# EAGLE design mainboard_v6.0.2 (EAGLE 9.6.2)
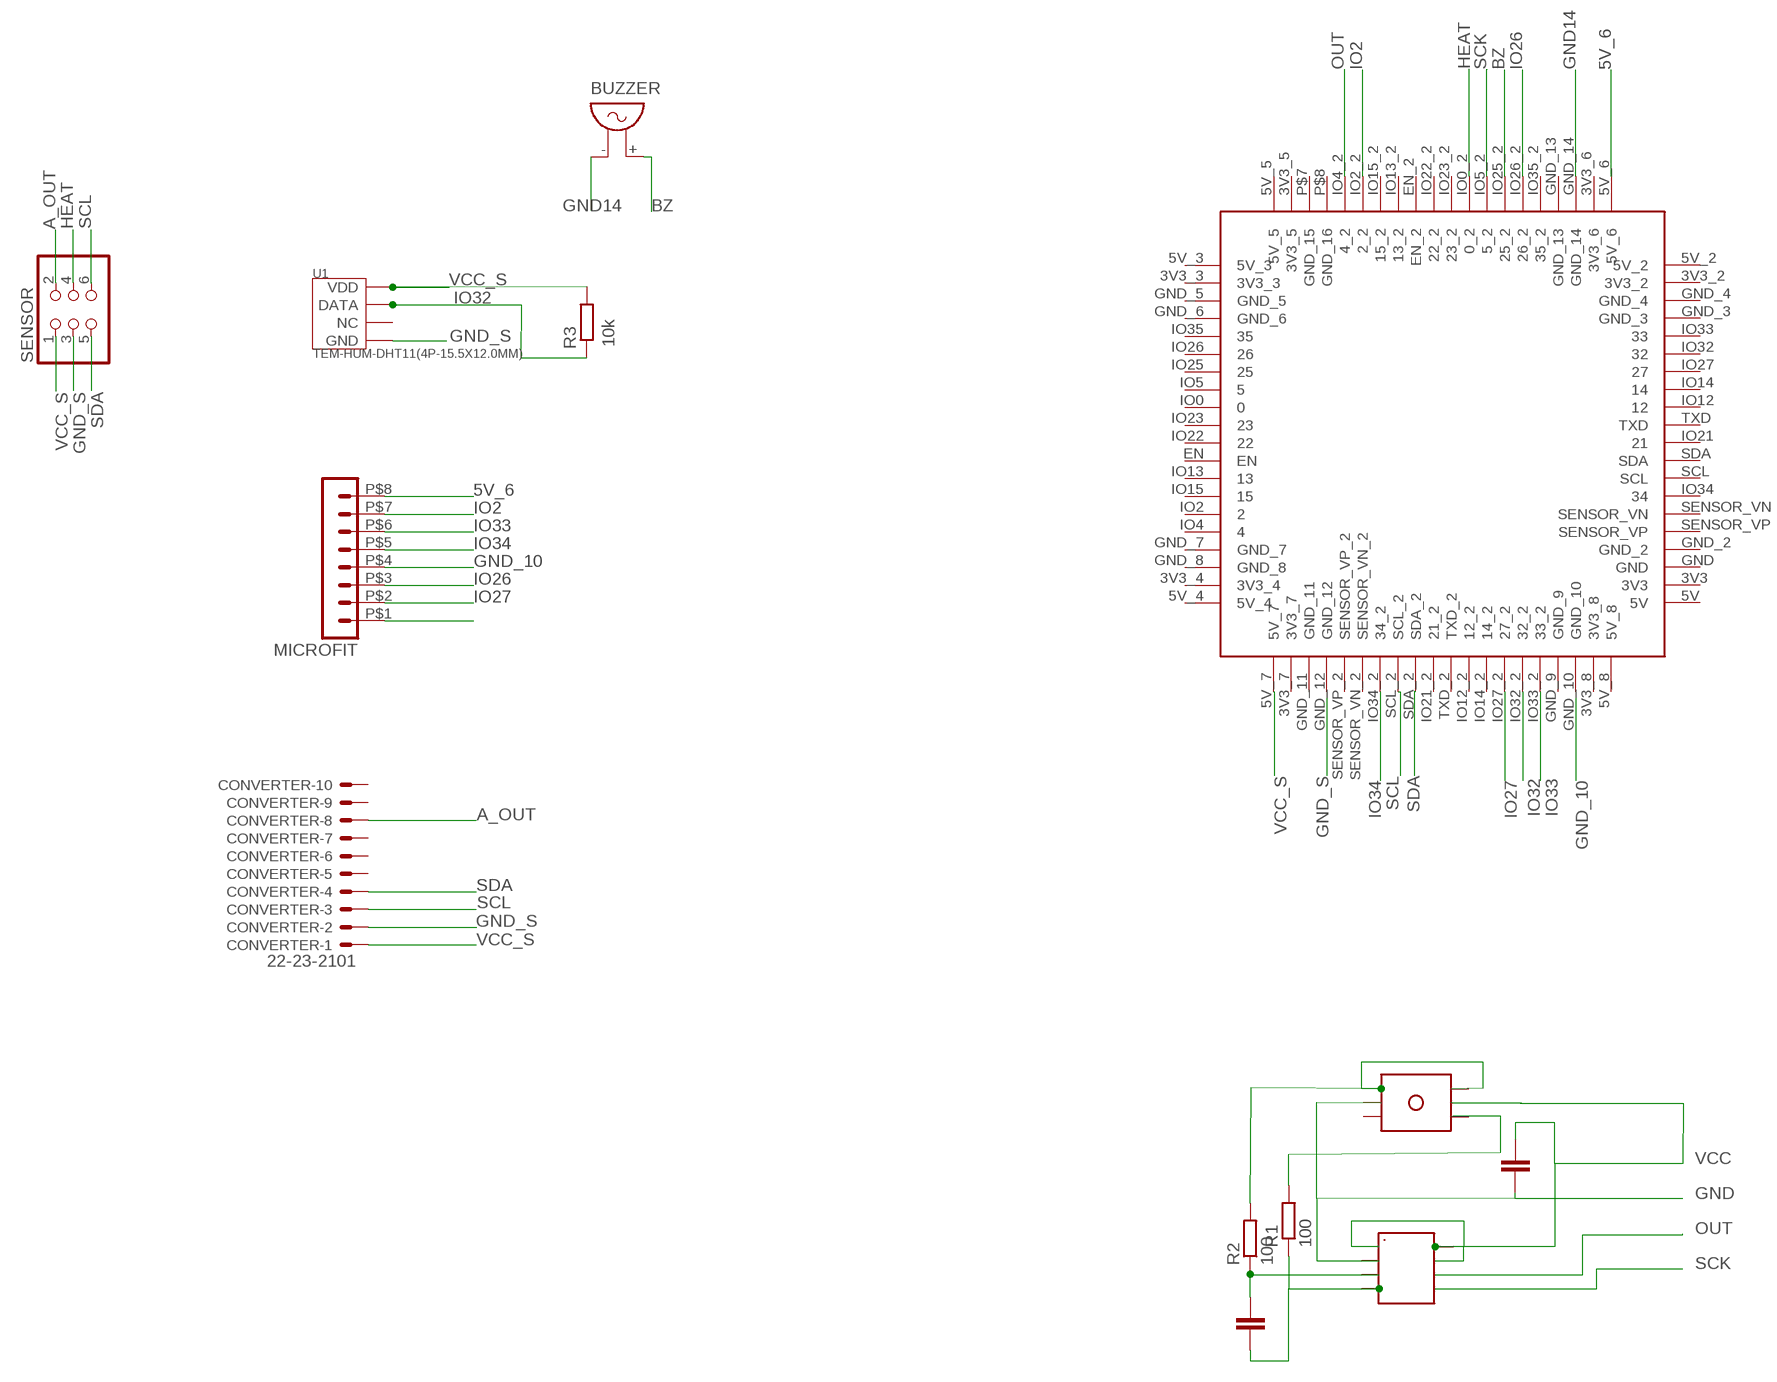
[diagram p0: schematic, sheet 1]

## Parts
BUZZER  F/QMX  [F/QMX]
C1  100n  C-EUC0805  [C0805]
C2  100n  C-EUC0805  [C0805]
CONVERTER  22-23-2101  [22-23-2101]
MICROFIT  HEADER_POS8_43045-0800  [43045-0800]
R1  100  R-EU_R0805  [R0805]
R2  100  R-EU_R0805  [R0805]
R3  10k  R-EU_R0805  [R0805]
SENSOR  PINHD-2X3  [2X03]
U1  TEM-HUM-DHT11(4P-15.5X12.0MM)  [SNR4-2.54-15.5X12.0X5.5MM]
U$1  WT32_SC01WT32_D  [WT32_DUPLICATED]
U$2  HX710B  [HX710B_SMD]
U$3  PRESSUREPRESSURE_PTH  [PRESSURE_PTH]

## Nets
5V_6: MICROFIT.P$8 U$1.5V_6
A_OUT: CONVERTER.8 SENSOR.2
BZ: BUZZER.+ U$1.IO25_2(25_2)
GND: C2.2 U$2.AGND U$3.2
GND14: BUZZER.- U$1.GND_14
GND_10: MICROFIT.P$4 U$1.GND_10
GND_S: CONVERTER.2 SENSOR.3 U1.4(GND) U$1.GND_12
HEAT: SENSOR.4 U$1.IO0_2(0_2)
IO2: MICROFIT.P$7 U$1.IO2_2(2_2)
IO26: MICROFIT.P$3 U$1.IO26_2(26_2)
IO27: MICROFIT.P$2 U$1.IO27_2(27_2)
IO32: R3.1 U1.2(DATA) U$1.IO32_2(32_2)
IO33: MICROFIT.P$6 U$1.IO33_2(33_2)
IO34: MICROFIT.P$5 U$1.IO34_2(34_2)
N$1: C1.2 R2.1 U$2.INN
N$2: C1.1 R1.1 U$2.INP
N$5: R1.2 U$3.4
N$7: R2.2 U$3.1 U$3.6
N$8: MICROFIT.P$1
OUT: U$1.IO4_2(4_2) U$2.DOUT
SCK: U$1.IO5_2(5_2) U$2.SCK
SCL: CONVERTER.3 SENSOR.6 U$1.SCL_2
SDA: CONVERTER.4 SENSOR.5 U$1.SDA_2
VCC: C2.1 U$2.AVDD U$2.DVDD U$2.VREF U$3.5
VCC_S: CONVERTER.1 R3.2 SENSOR.1 U1.1(VDD) U$1.5V_7
Unconnected: CONVERTER.5 CONVERTER.6 CONVERTER.7 CONVERTER.9 CONVERTER.10 U1.3(NC) U$1.3V3 U$1.3V3_2 U$1.3V3_3 U$1.3V3_4 U$1.3V3_5 U$1.3V3_6 U$1.3V3_7 U$1.3V3_8 U$1.5V U$1.5V_2 U$1.5V_3 U$1.5V_4 U$1.5V_5 U$1.5V_8 U$1.EN U$1.EN_2 U$1.GND U$1.GND_2 U$1.GND_3 U$1.GND_4 U$1.GND_5 U$1.GND_6 U$1.GND_7 U$1.GND_8 U$1.GND_9 U$1.GND_11 U$1.GND_13 U$1.IO0 U$1.IO2 U$1.IO4 U$1.IO5 U$1.IO12 U$1.IO12_2(12_2) U$1.IO13 U$1.IO13_2(13_2) U$1.IO14 U$1.IO14_2(14_2) U$1.IO15 U$1.IO15_2(15_2) U$1.IO21 U$1.IO21_2(21_2) U$1.IO22 U$1.IO22_2(22_2) U$1.IO23 U$1.IO23_2(23_2) U$1.IO25 U$1.IO26 U$1.IO27 U$1.IO32 U$1.IO33 U$1.IO34 U$1.IO35 U$1.IO35_2(35_2) U$1.P$7(GND_15) U$1.P$8(GND_16) U$1.SCL U$1.SDA U$1.SENSOR_VN U$1.SENSOR_VN_2 U$1.SENSOR_VP U$1.SENSOR_VP_2 U$1.TXD U$1.TXD_2 U$3.3

## Library data of the parts
BUZZER = buzzer:F/QMX: BUZZER Source: Buerklin; OC_FARNELL: unknown; OC_NEWARK: unknown
C1 C2 = rcl@1:C-EU: CAPACITOR, European symbol
CONVERTER = con-molex:22-23-2101: .100" (2.54mm) Center Header - 10 Pin; MF: MOLEX; MPN: 22-23-2101; OC_FARNELL: 1756828; OC_NEWARK: 94C0765
MICROFIT = con-molex-micro-fit-3_0 (1):HEADER_POS8_?: Molex - Micro-Fit 3.0 Series connector, 3.00mm (0.118") pitch header, 8 positions.
R1-R3 = rcl:R-EU_: RESISTOR, European symbol; SPICEPREFIX: R
SENSOR = pinhead:PINHD-2X3: PIN HEADER
U1 = TEM-HUM-DHT11_4P-15.5X12.0MM_:TEM-HUM-DHT11(4P-15.5X12.0MM): 314010000 Check availability <https://pricing.snapeda.com/parts/DHT11/Panasonic%20Industrial%20Automation%20Sales/view-part?ref=eda>; AVAILABILITY: Not in stock; CHECK_PRICES: https://www.snapeda.com/parts/DHT11/Panasonic/view-part/?ref=eda; DESCRIPTION: Servo AC 100 ~ 120VAC Supply 10A 120V Load; MF: Panasonic Industrial Automation Sales; MP: DHT11; PACKAGE: None; PRICE: None; SNAPEDA_LINK: https://www.snapeda.com/parts/DHT11/Panasonic/view-part/?ref=snap
U$1 = WT32_SC01:WT32_SC01
U$2 = HX710B:HX710B
U$3 = PRESSURE:PRESSURE

## Board
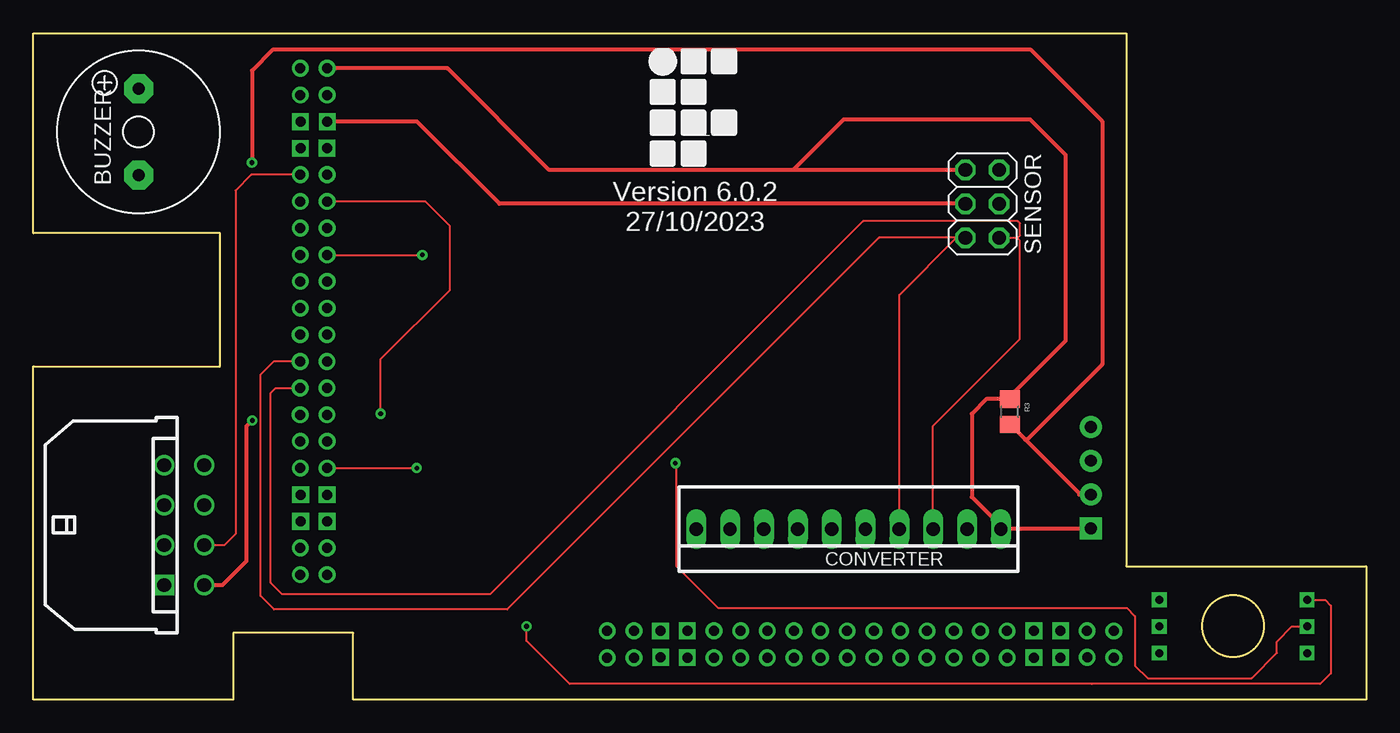
[diagram p1: board, top side]
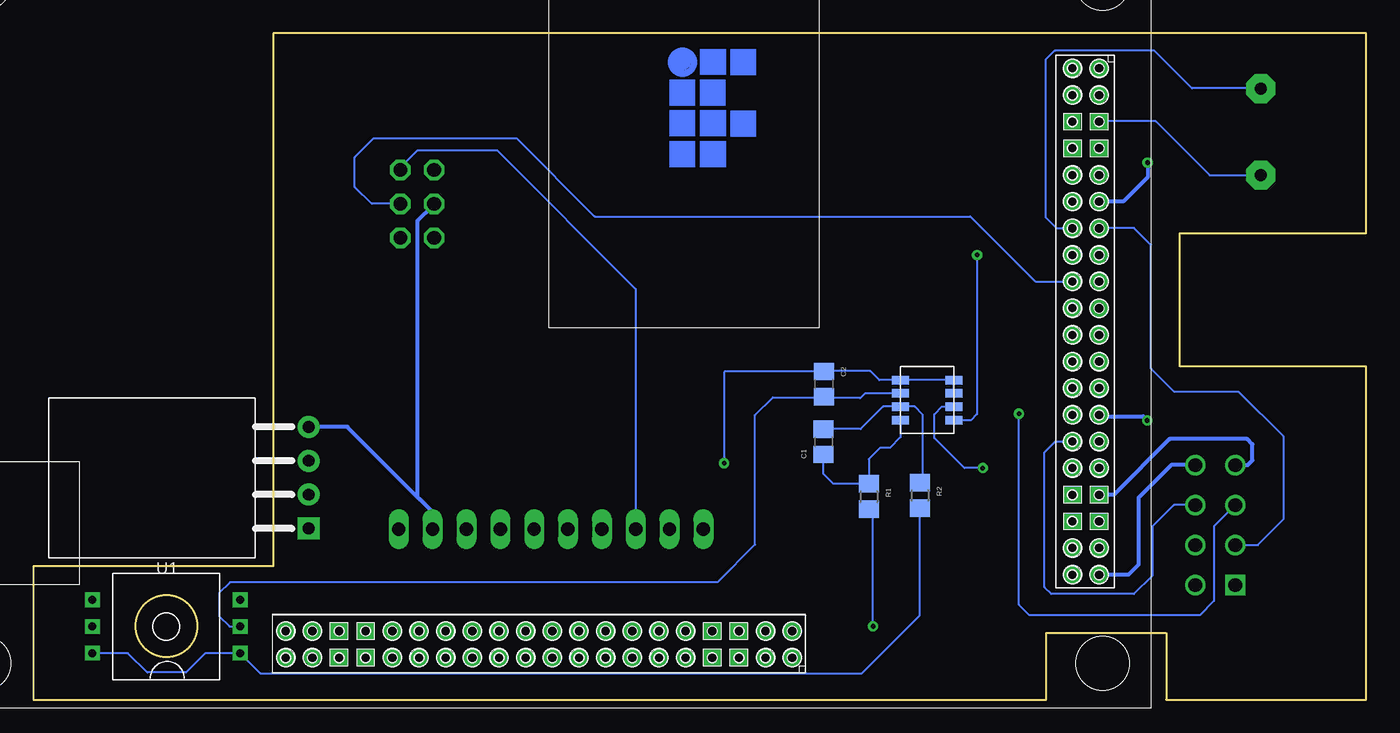
[diagram p2: board, bottom side, seen from below]

Size 100 x 50 mm. Coordinates in mm from the lower left corner, seen from the top.
Outline: 0,0 0,25 14,25 14,35 0,35 0,50 82,50 82,10 100,10 100,0 24,0 24,5 15,5 15,0 0,0
Outline: circle at 90,5.5 radius 2.3
Copper layers (1*16): Top 0.035mm / dielectric 1.5mm / Bottom 0.035mm
Design rules "default": minimum track width 6mil, minimum drill 0.35mm, track to track 6mil, track to pad 6mil, pad to pad 6mil, via to via 6mil, smd to smd 6mil, copper to edge 40mil, drill to drill 6mil, minimum pad ring 10mil, minimum via ring 8mil, stop-mask expansion 4mil, vias tented up to drill 0mil, thermal gap 10mil

### Footprints (pad centres in the part's own frame; a part is rotated, then mirrored left to right if it is on the bottom)
F/QMX = drill 0.914 pad 2.159 octagon: + 3.251,0; - -3.251,0
C0805 = smd 1.3 x 1.5: 1 -0.95,0; 2 0.95,0
22-23-2101 = drill 1 long: 1 -11.43,0; 2 -8.89,0; 3 -6.35,0; 4 -3.81,0; 5 -1.27,0; 6 1.27,0; 7 3.81,0; 8 6.35,0; 9 8.89,0; 10 11.43,0
43045-0800 = drill 1.02 square: P$1 4.5,4.32 | drill 1.02: P$2 1.5,4.32; P$3 -1.5,4.32; P$4 -4.5,4.32; P$5 4.5,7.32; P$6 1.5,7.32; P$7 -1.5,7.32; P$8 -4.5,7.32
R0805 = smd 1.3 x 1.5: 1 -0.95,0; 2 0.95,0
2X03 = drill 1.016 octagon: 1 -2.54,-1.27; 2 -2.54,1.27; 3 0,-1.27; 4 0,1.27; 5 2.54,-1.27; 6 2.54,1.27
SNR4-2.54-15.5X12.0X5.5MM = drill 0.889 pad 1.651 square: 1 -11.75,3.81 | drill 0.889 pad 1.651: 2 -11.75,1.27; 3 -11.75,-1.27; 4 -11.75,-3.81
WT32_DUPLICATED = drill 0.75: 3V3 -34.46,-21.65; 3V3_2 -34.47,-23.64; 3V3_3 -0.47,-21.65; 3V3_4 -0.47,-23.66; 3V3_5 22.56,-15.42; 3V3_6 24.57,-15.42; 3V3_7 22.56,18.57; 3V3_8 24.57,18.57; 5V -36.47,-21.66; 5V_2 -36.46,-23.65; 5V_3 1.54,-21.65; 5V_4 1.54,-23.66; 5V_5 22.56,-17.43; 5V_6 24.57,-17.43; 5V_7 22.56,20.58; 5V_8 24.57,20.58; EN -20.46,-21.65; EN_2 22.57,-1.43; IO0 -14.46,-21.65; IO0_2 22.56,4.58; IO2 -26.46,-21.66; IO2_2 22.56,-7.42; IO4 -28.46,-21.66; IO4_2 22.56,-9.43; IO5 -12.46,-21.65; IO5_2 22.56,6.57; IO12 -14.46,-23.65; IO12_2 24.57,4.58; IO13 -22.46,-21.66; IO13_2 22.57,-3.42; IO14 -12.46,-23.66; IO14_2 24.57,6.57; IO15 -24.46,-21.66; IO15_2 22.57,-5.43; IO21 -18.46,-23.65; IO21_2 24.58,0.58; IO22 -18.47,-21.66; IO22_2 22.57,0.58; IO23 -16.46,-21.66; IO23_2 22.56,2.57; IO25 -10.47,-21.65; IO25_2 22.56,8.58; IO26 -8.47,-21.65; IO26_2 22.56,10.58; IO27 -10.47,-23.66; IO27_2 24.57,8.58; IO32 -8.47,-23.66; IO32_2 24.57,10.58; IO33 -6.46,-23.66; IO33_2 24.57,12.59; IO34 -24.47,-23.66; IO34_2 24.58,-5.43; IO35 -6.46,-21.65; IO35_2 22.56,12.59; SCL -22.45,-23.66; SCL_2 24.58,-3.42; SDA -20.47,-23.66; SDA_2 24.58,-1.43; SENSOR_VN -26.47,-23.66; SENSOR_VN_2 24.57,-7.42; SENSOR_VP -28.47,-23.66; SENSOR_VP_2 24.57,-9.43; TXD -16.47,-23.66; TXD_2 24.57,2.57 | drill 0.75 square: GND -32.47,-21.65; GND_2 -30.47,-21.65; GND_3 -32.47,-23.65; GND_4 -30.47,-23.65; GND_5 -4.47,-21.65; GND_6 -2.46,-21.66; GND_7 22.56,-13.43; GND_8 22.56,-11.43; GND_9 24.55,-13.43; GND_10 24.55,-11.43; GND_11 22.57,14.58; GND_12 22.54,16.57; GND_13 24.56,14.57; GND_14 24.56,16.56; P$7 -4.47,-23.65; P$8 -2.47,-23.64
HX710B_SMD = smd 1.27 x 0.635: AGND -5,4; AVDD -1,5; DOUT -1,3; DVDD -1,4; INN -5,3; INP -5,2; SCK -1,2; VREF -5,5
PRESSURE_PTH = drill 0.6 square: 1 -10.54,7; 2 -10.54,5; 3 -10.54,3; 4 0.54,3; 5 0.54,5; 6 0.54,7

### Placement (x,y rotation side)
BUZZER  7.9,42.6 90 top
C1  40.71,19.34 90 bottom
C2  40.68,23.67 270 bottom
CONVERTER  61.16,12.8 180 top
MICROFIT  5.5,13.1 270 top
R1  37.31,15.24 270 bottom
R2  33.49,15.32 270 bottom
R3  73.25,21.6 90 top
SENSOR  71.2,37.2 270 top
U1  91.1,16.65 180 bottom
U$1  44.6,26.8 0 bottom
U$2  29.94,18.98 0 bottom
U$3  95.03,10.48 180 bottom

### Tracks (layer width: path | path; a pad name or v marks a point on that pad's centre or on a via)
5V_6
  Bottom 0.305: MICROFIT.P$8 14.63,17.6 17.09,15.14 17.09,10.11 17.83,9.37 U$1.5V_6
A_OUT
  Bottom 0.152: CONVERTER.8 54.81,30.81 65.22,41.22 71.17,41.22 72.47,39.92 SENSOR.2
BZ
  Bottom 0.152: 13.05,45.85 13.11,45.91 | 13.11,45.91 15.89,48.69 23.38,48.69 24.06,48.01 24.06,36.2 23.24,35.38 U$1.IO25_2 | 13.11,45.91 7.96,45.91 BUZZER.+
GND
  Bottom 0.152: U$2.AGND 37.6,22.98 37.96,22.62 40.18,22.62 | 40.18,22.62 40.58,22.62 C2.2 | 40.18,22.62 40.24,22.68 44.51,22.68 45.85,21.34 45.85,11.63 48.68,8.8 85.25,8.8 86.05,8 86.05,6.25 85.28,5.48 U$3.2
GND14
  Bottom 0.152: U$1.GND_14 20,43.4 15.8,43.4 11.75,39.35 BUZZER.-
GND_10
  Bottom 0.305: MICROFIT.P$4 8.89,17.6 8.54,17.95 8.54,19.15 8.93,19.54 14.76,19.54 18.93,15.37 U$1.GND_10
GND_S
  Top 0.152: U$1.GND_12
  Top 0.305: SENSOR.3 34.97,37.2 28.79,43.38 U$1.GND_12
  Bottom 0.305: SENSOR.3 69.94,37.15 71.19,35.9 71.19,15.21 | CONVERTER.2 70.05,14.07 70.99,15.01 71.19,15.21 | 71.19,15.21 76.44,20.46 U1.4
HEAT
  Bottom 0.152: SENSOR.4 74.61,37.2 75.88,38.47 75.88,40.7 74.46,42.12 63.75,42.12 57.89,36.26 29.7,36.26 24.82,31.38 U$1.IO0_2
IO2
  Bottom 0.152: MICROFIT.P$7 14.42,14.6 16.04,12.98 16.04,9.3 17.42,7.92 23.63,7.92 24.14,8.43 24.14,18.55 23.31,19.38 U$1.IO2_2
IO26  (via drill 0.35)
  Top 0.152: v26.05,21.45 26.05,25.55 31.25,30.75 31.25,35.55 29.42,37.38 U$1.IO26_2
  Bottom 0.152: MICROFIT.P$3 11.42,13 11.42,7.4 12.49,6.33 25.27,6.33 26.05,7.11 v26.05,21.45
IO27
  Bottom 0.152: MICROFIT.P$2 8.13,11.6 6.19,13.54 6.19,19.73 9.56,23.1 14.4,23.1 16.15,24.85 16.15,34.11 17.43,35.39 U$1.IO27_2
IO32  (via drill 0.35)
  Top 0.152: 19.98,37.43 U$1.IO32_2
  Top 0.305: v16.4,40.3 16.4,47.2 17.95,48.76 74.84,48.76 80.2,43.4 80.2,25.15 74.56,19.52 74.42,19.52 | 78.45,15.38 U1.2 78.55,15.38 74.42,19.52 | 74.42,19.52 73.28,20.65 R3.1
  Bottom 0.305: v16.4,40.3 16.4,39.2 18.22,37.38 U$1.IO32_2
IO33
  Top 0.152: U$1.IO33_2 16.35,39.39 15.17,38.21 15.17,12.42 14.32,11.57 12.85,11.57 MICROFIT.P$6
IO34  (via drill 0.35)
  Top 0.305: MICROFIT.P$5 14.2,8.6 16,10.4 16,20.52 v16.43,20.95
  Bottom 0.305: v16.43,20.95 16.73,21.25 19.9,21.25 U$1.IO34_2
N$1
  Bottom 0.152: C1.2 37.93,20.29 36.24,21.98 U$2.INN 33.87,21.98 33.3,21.41 33.3,16.46 R2.1
N$2
  Bottom 0.152: U$2.INP 34.94,19.69 35.74,18.89 36.47,18.89 37.31,18.05 R1.1 39.97,16.19 40.71,16.93 C1.1
N$5  (via drill 0.35)
  Top 0.152: U$3.4 96.92,7.48 97.35,7.05 97.35,1.97 96.55,1.17 79.45,1.17 79.38,1.17 40.23,1.17 37,4.4 v37,5.5
  Bottom 0.152: v37,5.5 37,13.98 R1.2
N$7
  Bottom 0.152: R2.2 33.49,6.31 37.83,1.97 82.98,1.97 U$3.1 87.1,3.48 88.55,2.03 91.45,2.03 92.9,3.48 U$3.6
OUT  (via drill 0.35)
  Top 0.152: U$1.IO4_2 v28.77,17.37
  Bottom 0.152: v28.77,17.37 30.14,17.37 32.4,19.63 32.4,21.41 31.83,21.98 U$2.DOUT
SCK  (via drill 0.35)
  Top 0.152: U$1.IO5_2 v29.19,33.37 29.21,33.37
  Bottom 0.152: v29.19,33.37 29.19,21.42 29.66,20.95 30.91,20.95 U$2.SCK
SCL
  Top 0.152: SENSOR.6 73.78,34.66 | 73.78,34.66 73.85,34.66 74.02,34.83 74.02,35.74 73.86,35.9 62.25,35.9 34.25,7.9 18.68,7.9 17.82,8.76 17.82,23.02 18.18,23.38 U$1.SCL_2 | CONVERTER.3 67.51,20.54 74.01,27.04 74.01,34.43 73.78,34.66
SDA
  Top 0.152: SENSOR.5 69.26,34.66 | 69.26,34.66 63.45,34.66 35.55,6.76 18.06,6.76 17.04,7.78 17.04,24.38 18.05,25.39 20,25.39 U$1.SDA_2 | CONVERTER.4 64.97,30.37 69.26,34.66
VCC  (via drill 0.35)
  Top 0.152: v48.17,17.74 48.22,17.69 48.22,10.03 51.38,6.87 82.03,6.87 82.65,6.25 82.65,2.55 83.6,1.6 91.4,1.6 93.3,3.5 93.3,4.35 94.43,5.48 U$3.5 95.43,5.48
  Bottom 0.152: U$2.DVDD U$2.AVDD U$2.VREF 36.53,23.98 37.2,24.65 40.65,24.65 C2.1 48.11,24.62 48.17,24.56 v48.17,17.74 48.17,17.67
VCC_S
  Top 0.305: SENSOR.1 57.01,39.74 | 57.01,39.74 38.71,39.74 31.07,47.38 U$1.5V_7 | 72.69,12.9 CONVERTER.1 79.31,12.8 U1.1 | 72.69,12.9 73.04,13.25 | 57.01,39.74 60.79,43.52 74.8,43.52 77.46,40.86 77.46,26.93 73.08,22.55 R3.2 71.5,22.55 70.4,21.45 70.4,15.2 72.69,12.9
(copper drawn outside any net)
  shapes: Bottom area x9, Bottom circle x3

### Text on the board
tNames: Version 6.0.2 / 27/10/2023